# Altium schematic sheet S7CAS-PLEIADES-CARTE-FILLE_P02_CONNECTEUR_FMC.SchDoc
size Tabloid; DocumentNumber: 3; SheetNumber: 3; SheetTotal: 5; Size: 11x17; Sheet_Name: CONNECTEUR FMC
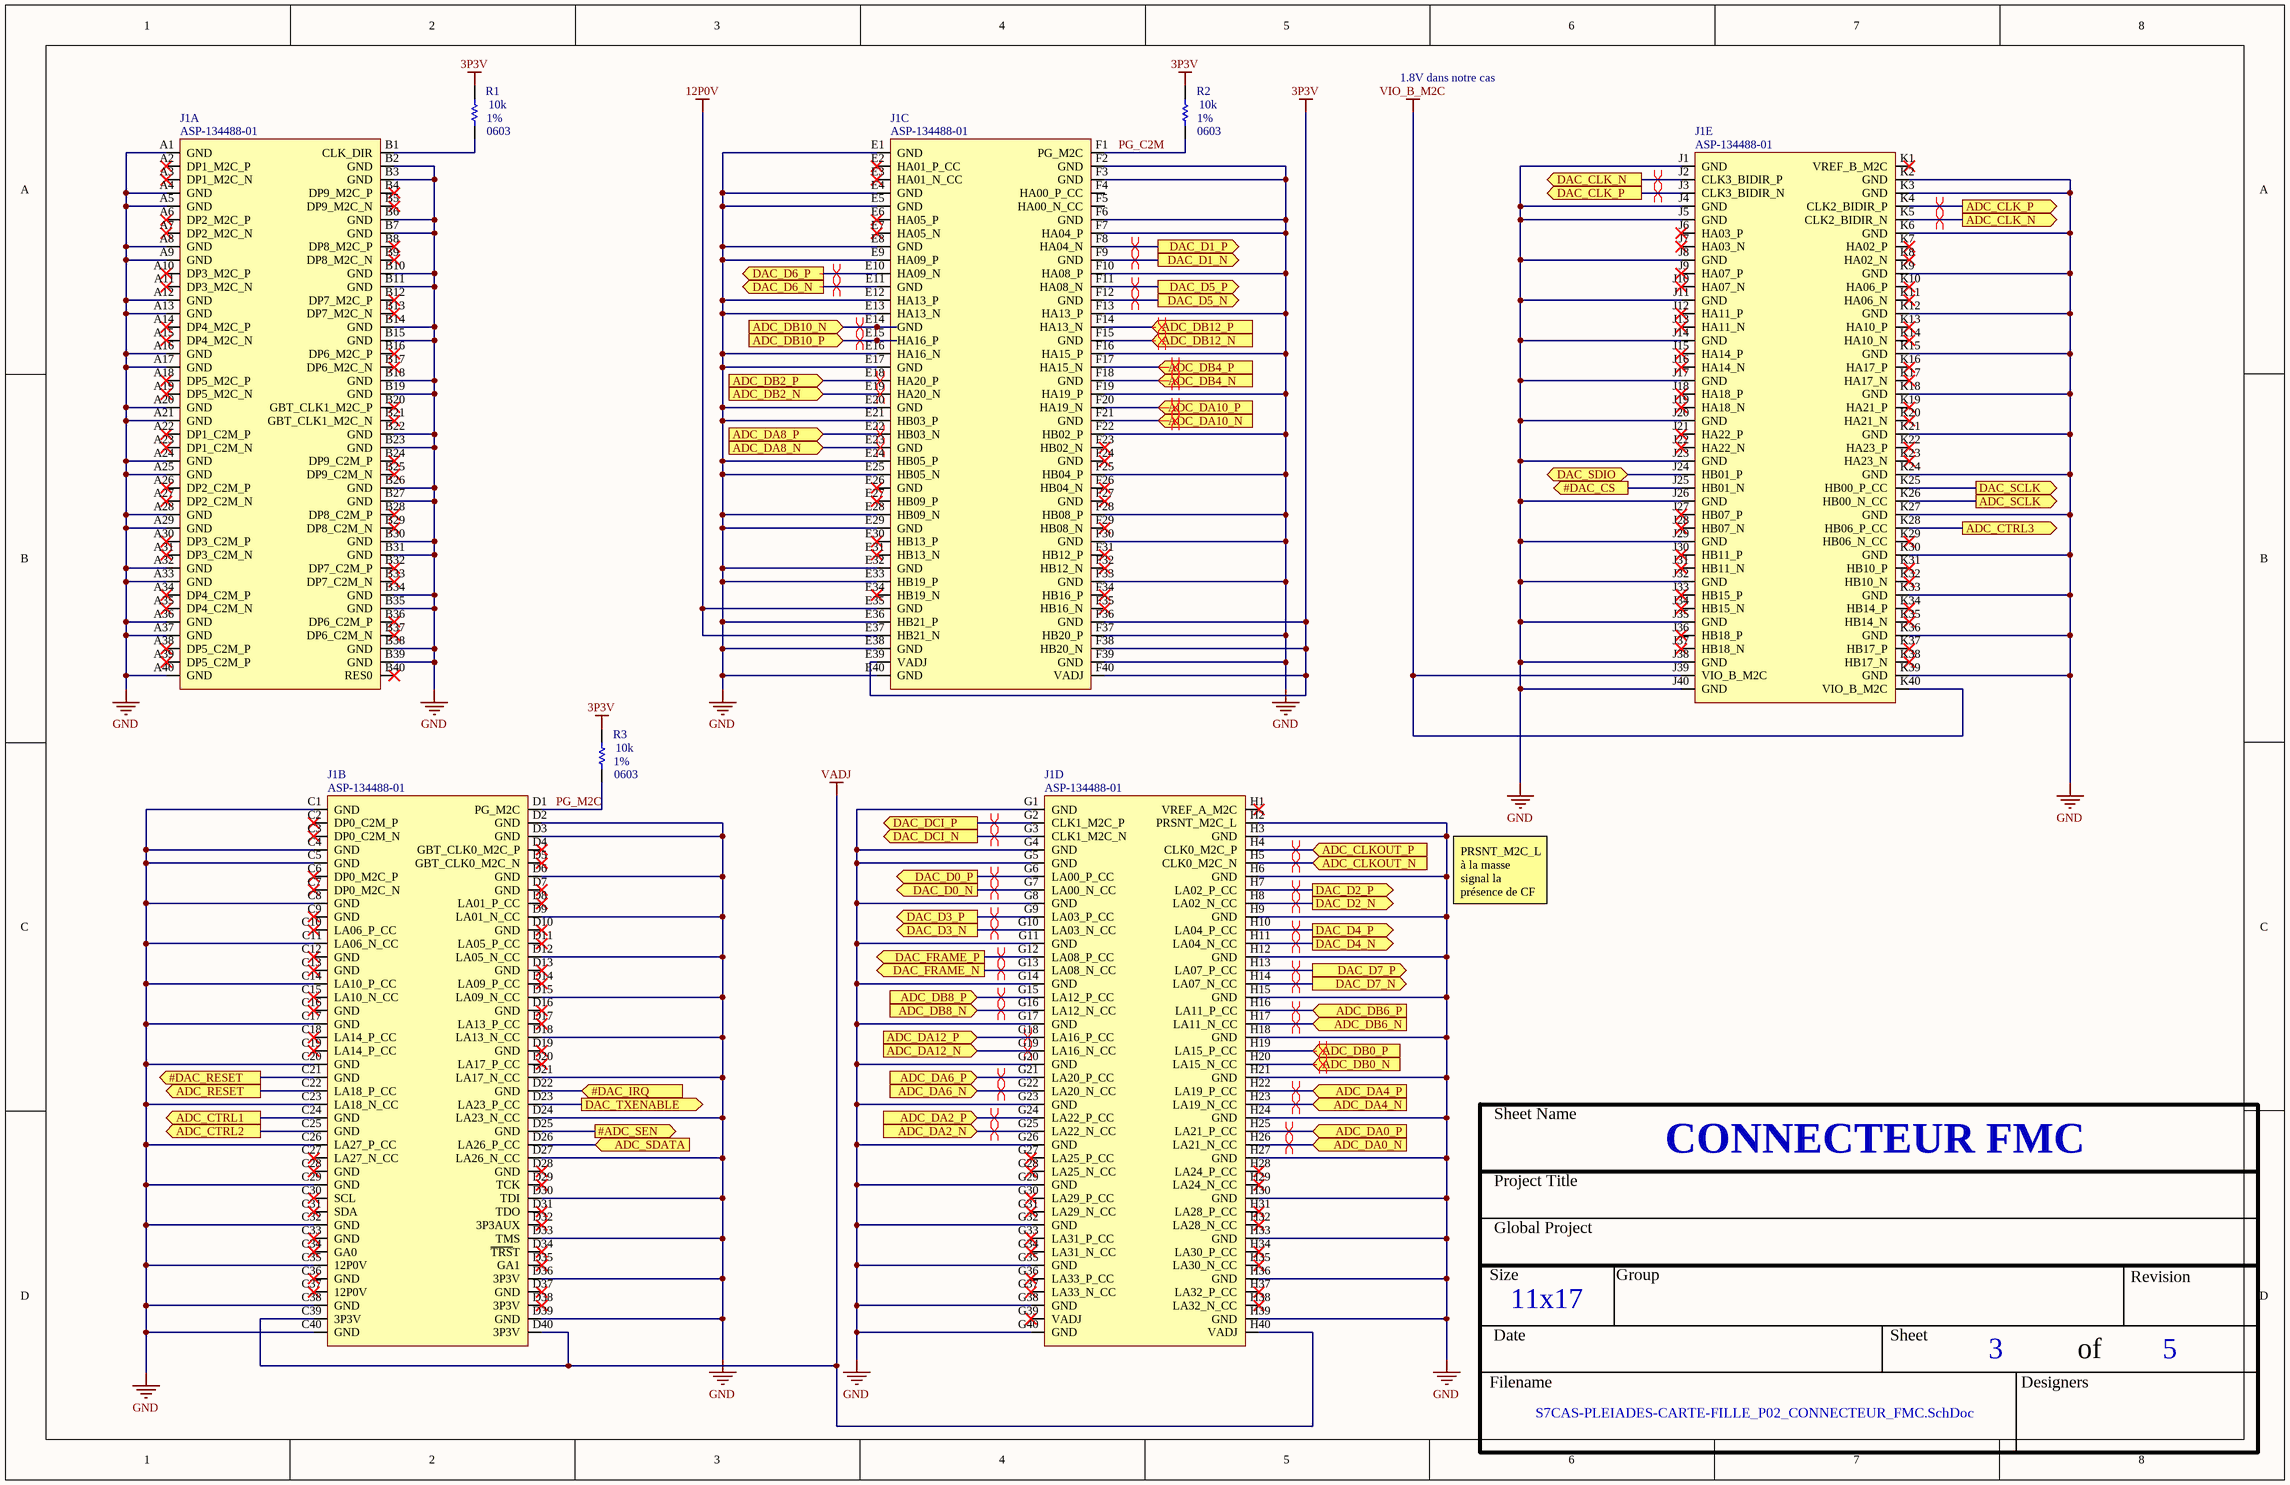
[diagram p0: S7CAS-PLEIADES-CARTE-FILLE_P02_CONNECTEUR_FMC.SchDoc]

## Parts
J1  ASP-134488-01  [CONN_SAMTEC_ASP-134488-01]  (parts A,B,C,D,E of 5)
R1  value 10k  Package: 0603  Precision: 1%  [RES_0603]  (hidden comment: RES - 0603)
R2  value 10k  Package: 0603  Precision: 1%  [RES_0603]  (hidden comment: RES - 0603)
R3  value 10k  Package: 0603  Precision: 1%  [RES_0603]  (hidden comment: RES - 0603)

## Ports
#ADC_SEN (out), #DAC_CS (out), #DAC_IRQ (in), #DAC_RESET (out), ADC_CLK_N (out), ADC_CLK_P (out), ADC_CLKOUT_N (in), ADC_CLKOUT_P (in), ADC_CTRL1 (out), ADC_CTRL2 (out), ADC_CTRL3 (out), ADC_DA0_N (in), ADC_DA0_P (in), ADC_DA2_N (in), ADC_DA2_P (in), ADC_DA4_N (in), ADC_DA4_P (in), ADC_DA6_N (in), ADC_DA6_P (in), ADC_DA8_N (in), ADC_DA8_P (in), ADC_DA10_N (in), ADC_DA10_P (in), ADC_DA12_N (in), ADC_DA12_P (in), ADC_DB0_N (in), ADC_DB0_P (in), ADC_DB2_N (in), ADC_DB2_P (in), ADC_DB4_N (in), ADC_DB4_P (in), ADC_DB6_N (in), ADC_DB6_P (in), ADC_DB8_N (in), ADC_DB8_P (in), ADC_DB10_N (in), ADC_DB10_P (in), ADC_DB12_N (in), ADC_DB12_P (in), ADC_RESET (out), ADC_SCLK (out), ADC_SDATA (in), DAC_CLK_N (out), DAC_CLK_P (out), DAC_D0_N (out), DAC_D0_P (out), DAC_D1_N (out), DAC_D1_P (out), DAC_D2_N (out), DAC_D2_P (out), DAC_D3_N (out), DAC_D3_P (out), DAC_D4_N (out), DAC_D4_P (out), DAC_D5_N (out), DAC_D5_P (out), DAC_D6_N (out), DAC_D6_P (out), DAC_D7_N (out), DAC_D7_P (out), DAC_DCI_N (out), DAC_DCI_P (out), DAC_FRAME_N (out), DAC_FRAME_P (out), DAC_SCLK (out), DAC_SDIO (bidir), DAC_TXENABLE (out)

## Nets
3P3V: J1.E39(VADJ) J1.F36(GND) J1.F38(HB20_N) J1.F40(VADJ) R1.2 R2.2 R3.2
12P0V: J1.E35(GND) J1.E37(HB21_N)
GND: J1.A1(GND) J1.A4(GND) J1.A5(GND) J1.A8(GND) J1.A9(GND) J1.A12(GND) J1.A13(GND) J1.A16(GND) J1.A17(GND) J1.A20(GND) J1.A21(GND) J1.A24(GND) J1.A25(GND) J1.A28(GND) J1.A29(GND) J1.A32(GND) J1.A33(GND) J1.A36(GND) J1.A37(GND) J1.A40(GND) J1.B2(GND) J1.B3(GND) J1.B6(GND) J1.B7(GND) J1.B10(GND) J1.B11(GND) J1.B14(GND) J1.B15(GND) J1.B18(GND) J1.B19(GND) J1.B22(GND) J1.B23(GND) J1.B26(GND) J1.B27(GND) J1.B30(GND) J1.B31(GND) J1.B34(GND) J1.B35(GND) J1.B38(GND) J1.B39(GND) J1.C1(GND) J1.C4(GND) J1.C5(GND) J1.C8(GND) J1.C11(LA06_N_CC) J1.C14(LA10_P_CC) J1.C17(GND) J1.C20(GND) J1.C23(LA18_N_CC) J1.C26(LA27_P_CC) J1.C29(GND) J1.C32(GND) J1.C35(12P0V) J1.C38(GND) J1.C40(GND) J1.D2(GND) J1.D3(GND) J1.D6(GND) J1.D9(LA01_N_CC) J1.D12(LA05_N_CC) J1.D15(LA09_N_CC) J1.D18(LA13_N_CC) J1.D21(LA17_N_CC) J1.D24(LA23_N_CC) J1.D27(LA26_N_CC) J1.D30(TDI) J1.D33(TMS) J1.D36(3P3V) J1.D39(GND) J1.E1(GND) J1.E4(GND) J1.E5(GND) J1.E8(GND) J1.E9(HA09_P) J1.E12(HA13_P) J1.E13(HA13_N) J1.E16(HA16_N) J1.E17(GND) J1.E20(GND) J1.E21(HB03_P) J1.E24(HB05_P) J1.E25(HB05_N) J1.E28(HB09_N) J1.E29(GND) J1.E32(GND) J1.E33(HB19_P) J1.E36(HB21_P) J1.E38(GND) J1.E40(GND) J1.F2(GND) J1.F3(GND) J1.F6(GND) J1.F7(HA04_P) J1.F10(HA08_P) J1.F13(HA13_P) J1.F16(HA15_P) J1.F19(HA19_P) J1.F22(HB02_P) J1.F25(HB04_P) J1.F28(HB08_P) J1.F30(GND) J1.F33(GND) J1.F37(HB20_P) J1.F39(GND) J1.G1(GND) J1.G4(GND) J1.G5(GND) J1.G8(GND) J1.G11(GND) J1.G14(GND) J1.G17(GND) J1.G20(GND) J1.G23(GND) J1.G26(GND) J1.G29(GND) J1.G32(GND) J1.G35(GND) J1.G38(GND) J1.G40(GND) J1.H2(PRSNT_M2C_L) J1.H3(GND) J1.H6(GND) J1.H9(GND) J1.H12(GND) J1.H15(GND) J1.H18(GND) J1.H21(GND) J1.H24(GND) J1.H27(GND) J1.H30(GND) J1.H33(GND) J1.H36(GND) J1.H39(GND) J1.J1(GND) J1.J4(GND) J1.J5(GND) J1.J8(GND) J1.J11(GND) J1.J14(GND) J1.J17(GND) J1.J20(GND) J1.J23(GND) J1.J26(GND) J1.J29(GND) J1.J32(GND) J1.J35(GND) J1.J38(GND) J1.J40(GND) J1.K2(GND) J1.K3(GND) J1.K6(GND) J1.K9(GND) J1.K12(GND) J1.K15(GND) J1.K18(GND) J1.K21(GND) J1.K24(GND) J1.K27(GND) J1.K30(GND) J1.K33(GND) J1.K36(GND) J1.K39(GND)
VADJ: J1.C39(3P3V) J1.D40(3P3V) J1.H40(VADJ)
VIO_B_M2C: J1.J39(VIO_B_M2C) J1.K40(VIO_B_M2C)
#ADC_SEN: J1.D25(GND) ; port #ADC_SEN
#DAC_CS: J1.J25(HB01_N) ; port #DAC_CS
#DAC_IRQ: J1.D22(GND) ; port #DAC_IRQ
#DAC_RESET: J1.C21(GND) ; port #DAC_RESET
ADC_CLK_N: J1.K5(CLK2_BIDIR_N) ; port ADC_CLK_N
ADC_CLK_P: J1.K4(CLK2_BIDIR_P) ; port ADC_CLK_P
ADC_CLKOUT_N: J1.H5(CLK0_M2C_N) ; port ADC_CLKOUT_N
ADC_CLKOUT_P: J1.H4(CLK0_M2C_P) ; port ADC_CLKOUT_P
ADC_CTRL1: J1.C24(GND) ; port ADC_CTRL1
ADC_CTRL2: J1.C25(GND) ; port ADC_CTRL2
ADC_CTRL3: J1.K28(HB06_P_CC) ; port ADC_CTRL3
ADC_DA0_N: J1.H26(LA21_N_CC) ; port ADC_DA0_N
ADC_DA0_P: J1.H25(LA21_P_CC) ; port ADC_DA0_P
ADC_DA2_N: J1.G25(LA22_N_CC) ; port ADC_DA2_N
ADC_DA2_P: J1.G24(LA22_P_CC) ; port ADC_DA2_P
ADC_DA4_N: J1.H23(LA19_N_CC) ; port ADC_DA4_N
ADC_DA4_P: J1.H22(LA19_P_CC) ; port ADC_DA4_P
ADC_DA6_N: J1.G22(LA20_N_CC) ; port ADC_DA6_N
ADC_DA6_P: J1.G21(LA20_P_CC) ; port ADC_DA6_P
ADC_DA8_N: J1.E23(GND) ; port ADC_DA8_N
ADC_DA8_P: J1.E22(HB03_N) ; port ADC_DA8_P
ADC_DA10_N: J1.F21(GND) ; port ADC_DA10_N
ADC_DA10_P: J1.F20(HA19_N) ; port ADC_DA10_P
ADC_DA12_N: J1.G19(LA16_N_CC) ; port ADC_DA12_N
ADC_DA12_P: J1.G18(LA16_P_CC) ; port ADC_DA12_P
ADC_DB0_N: J1.H20(LA15_N_CC) ; port ADC_DB0_N
ADC_DB0_P: J1.H19(LA15_P_CC) ; port ADC_DB0_P
ADC_DB2_N: J1.E19(HA20_N) ; port ADC_DB2_N
ADC_DB2_P: J1.E18(HA20_P) ; port ADC_DB2_P
ADC_DB4_N: J1.F18(GND) ; port ADC_DB4_N
ADC_DB4_P: J1.F17(HA15_N) ; port ADC_DB4_P
ADC_DB6_N: J1.H17(LA11_N_CC) ; port ADC_DB6_N
ADC_DB6_P: J1.H16(LA11_P_CC) ; port ADC_DB6_P
ADC_DB8_N: J1.G16(LA12_N_CC) ; port ADC_DB8_N
ADC_DB8_P: J1.G15(LA12_P_CC) ; port ADC_DB8_P
ADC_DB10_N: J1.E14(GND) ; port ADC_DB10_N
ADC_DB10_P: J1.E15(HA16_P) ; port ADC_DB10_P
ADC_DB12_N: J1.F15(GND) ; port ADC_DB12_N
ADC_DB12_P: J1.F14(HA13_N) ; port ADC_DB12_P
ADC_RESET: J1.C22(LA18_P_CC) ; port ADC_RESET
ADC_SCLK: J1.K26(HB00_N_CC) ; port ADC_SCLK
ADC_SDATA: J1.D26(LA26_P_CC) ; port ADC_SDATA
DAC_CLK_N: J1.J2(CLK3_BIDIR_P) ; port DAC_CLK_N
DAC_CLK_P: J1.J3(CLK3_BIDIR_N) ; port DAC_CLK_P
DAC_D0_N: J1.G7(LA00_N_CC) ; port DAC_D0_N
DAC_D0_P: J1.G6(LA00_P_CC) ; port DAC_D0_P
DAC_D1_N: J1.F9(GND) ; port DAC_D1_N
DAC_D1_P: J1.F8(HA04_N) ; port DAC_D1_P
DAC_D2_N: J1.H8(LA02_N_CC) ; port DAC_D2_N
DAC_D2_P: J1.H7(LA02_P_CC) ; port DAC_D2_P
DAC_D3_N: J1.G10(LA03_N_CC) ; port DAC_D3_N
DAC_D3_P: J1.G9(LA03_P_CC) ; port DAC_D3_P
DAC_D4_N: J1.H11(LA04_N_CC) ; port DAC_D4_N
DAC_D4_P: J1.H10(LA04_P_CC) ; port DAC_D4_P
DAC_D5_N: J1.F12(GND) ; port DAC_D5_N
DAC_D5_P: J1.F11(HA08_N) ; port DAC_D5_P
DAC_D6_N: J1.E11(GND) ; port DAC_D6_N
DAC_D6_P: J1.E10(HA09_N) ; port DAC_D6_P
DAC_D7_N: J1.H14(LA07_N_CC) ; port DAC_D7_N
DAC_D7_P: J1.H13(LA07_P_CC) ; port DAC_D7_P
DAC_DCI_N: J1.G3(CLK1_M2C_N) ; port DAC_DCI_N
DAC_DCI_P: J1.G2(CLK1_M2C_P) ; port DAC_DCI_P
DAC_FRAME_N: J1.G13(LA08_N_CC) ; port DAC_FRAME_N
DAC_FRAME_P: J1.G12(LA08_P_CC) ; port DAC_FRAME_P
DAC_SCLK: J1.K25(HB00_P_CC) ; port DAC_SCLK
DAC_SDIO: J1.J24(HB01_P) ; port DAC_SDIO
DAC_TXENABLE: J1.D23(LA23_P_CC) ; port DAC_TXENABLE
PG_C2M: J1.F1(PG_M2C) R2.1
PG_M2C: J1.D1(PG_M2C) R3.1
NetJ1_B1: J1.B1(CLK_DIR) R1.1

Not connected (* = marked no-connect by the designer): J1 A2(DP1_M2C_P)* A3(DP1_M2C_N)* A6(DP2_M2C_P)* A7(DP2_M2C_N)* A10(DP3_M2C_P)* A11(DP3_M2C_N)* A14(DP4_M2C_P)* A15(DP4_M2C_N)* A18(DP5_M2C_P)* A19(DP5_M2C_N)* A22(DP1_C2M_P)* A23(DP1_C2M_N)* A26(DP2_C2M_P)* A27(DP2_C2M_N)* A30(DP3_C2M_P)* A31(DP3_C2M_N)* A34(DP4_C2M_P)* A35(DP4_C2M_N)* A38(DP5_C2M_P)* A39(DP5_C2M_P)* B4(DP9_M2C_P)* B5(DP9_M2C_N)* B8(DP8_M2C_P)* B9(DP8_M2C_N)* B12(DP7_M2C_P)* B13(DP7_M2C_N)* B16(DP6_M2C_P)* B17(DP6_M2C_N)* B20(GBT_CLK1_M2C_P)* B21(GBT_CLK1_M2C_N)* B24(DP9_C2M_P)* B25(DP9_C2M_N)* B28(DP8_C2M_P)* B29(DP8_C2M_N)* B32(DP7_C2M_P)* B33(DP7_C2M_N)* B36(DP6_C2M_P)* B37(DP6_C2M_N)* B40(RES0)* C2(DP0_C2M_P)* C3(DP0_C2M_N)* C6(DP0_M2C_P)* C7(DP0_M2C_N)* C9(GND)* C10(LA06_P_CC)* C12(GND)* C13(GND)* C15(LA10_N_CC)* C16(GND)* C18(LA14_P_CC)* C19(LA14_P_CC)* C27(LA27_N_CC)* C28(GND)* C30(SCL)* C31(SDA)* C33(GND)* C34(GA0)* C36(GND)* C37(12P0V)* D4(GBT_CLK0_M2C_P)* D5(GBT_CLK0_M2C_N)* D7(GND)* D8(LA01_P_CC)* D10(GND)* D11(LA05_P_CC)* D13(GND)* D14(LA09_P_CC)* D16(GND)* D17(LA13_P_CC)* D19(GND)* D20(LA17_P_CC)* D28(GND)* D29(TCK)* D31(TDO)* D32(3P3AUX)* D34(~{TRS}T)* D35(GA1)* D37(GND)* D38(3P3V)* E2(HA01_P_CC)* E3(HA01_N_CC)* E6(HA05_P)* E7(HA05_N)* E26(GND)* E27(HB09_P)* E30(HB13_P)* E31(HB13_N)* E34(HB19_N)* F4(HA00_P_CC) F5(HA00_N_CC) F23(HB02_N)* F24(GND)* F26(HB04_N)* F27(GND)* F29(HB08_N)* F31(HB12_P)* F32(HB12_N)* F34(HB16_P)* F35(HB16_N)* G27(LA25_P_CC)* G28(LA25_N_CC)* G30(LA29_P_CC)* G31(LA29_N_CC)* G33(LA31_P_CC)* G34(LA31_N_CC)* G36(LA33_P_CC)* G37(LA33_N_CC)* G39(VADJ)* H1(VREF_A_M2C)* H28(LA24_P_CC)* H29(LA24_N_CC)* H31(LA28_P_CC)* H32(LA28_N_CC)* H34(LA30_P_CC)* H35(LA30_N_CC)* H37(LA32_P_CC)* H38(LA32_N_CC)* J6(HA03_P)* J7(HA03_N)* J9(HA07_P)* J10(HA07_N)* J12(HA11_P)* J13(HA11_N)* J15(HA14_P)* J16(HA14_N)* J18(HA18_P)* J19(HA18_N)* J21(HA22_P)* J22(HA22_N)* J27(HB07_P)* J28(HB07_N)* J30(HB11_P)* J31(HB11_N)* J33(HB15_P)* J34(HB15_N)* J36(HB18_P)* J37(HB18_N)* K1(VREF_B_M2C)* K7(HA02_P)* K8(HA02_N)* K10(HA06_P)* K11(HA06_N)* K13(HA10_P)* K14(HA10_N)* K16(HA17_P)* K17(HA17_N)* K19(HA21_P)* K20(HA21_N)* K22(HA23_P)* K23(HA23_N)* K29(HB06_N_CC)* K31(HB10_P)* K32(HB10_N)* K34(HB14_P)* K35(HB14_N)* K37(HB17_P)* K38(HB17_N)*

## Layout directives
differential pair; differential pair class DAC_DIF: (no net found under the mark), DAC_CLK_N, DAC_CLK_P, DAC_D0_N, DAC_D0_P, DAC_D1_N, DAC_D1_P, DAC_D2_N, DAC_D2_P, DAC_D3_N, DAC_D3_P, DAC_D4_N, DAC_D4_P, DAC_D5_N, DAC_D5_P, DAC_D7_N, DAC_D7_P, DAC_DCI_N, DAC_DCI_P, DAC_FRAME_N, DAC_FRAME_P
differential pair; differential pair class ADC_DIF: ADC_CLK_N, ADC_CLK_P, ADC_CLKOUT_N, ADC_CLKOUT_P, ADC_DA0_N, ADC_DA0_P, ADC_DA2_N, ADC_DA2_P, ADC_DA4_N, ADC_DA4_P, ADC_DA6_N, ADC_DA6_P, ADC_DA8_N, ADC_DA8_P, ADC_DA10_N, ADC_DA10_P, ADC_DA12_N, ADC_DA12_P, ADC_DB0_N, ADC_DB0_P, ADC_DB2_N, ADC_DB2_P, ADC_DB4_N, ADC_DB4_P, ADC_DB6_N, ADC_DB6_P, ADC_DB8_N, ADC_DB8_P, ADC_DB10_N, ADC_DB10_P, ADC_DB12_N, ADC_DB12_P

## Notes on the sheet
- 1.8V dans notre cas
- PRSNT_M2C_L à la masse signal la présence de CF à CM
- Sheet Name
- Project Title
- Global Project
- Size
- Group
- Revision
- Date
- Sheet
- of
- Filename
- Designers

## Library data of the parts
J1 = CONN_SAMTEC_ASP-134488-01: CONN - VITA 57 MEZZ MALE (DAUGHTERBOARD) HIGH DENSITY - SMD-400; Voltage: 240VAC; Current: 1.8A; Mfg: Samtec; Power: *; Mfg Part Number: ASP-134488-01; HelpURL: http://suddendocs.samtec.com/prints/asp-134488-01-mkt.pdf; CreatedBy: Jonathan Bouchard; Temperature: -55 °C to +125 °C; Value: *; Precision: *; Package: SMD-400
R1-R3 = RES - 0603: Current: *; CreatedBy: Jonathan Bouchard